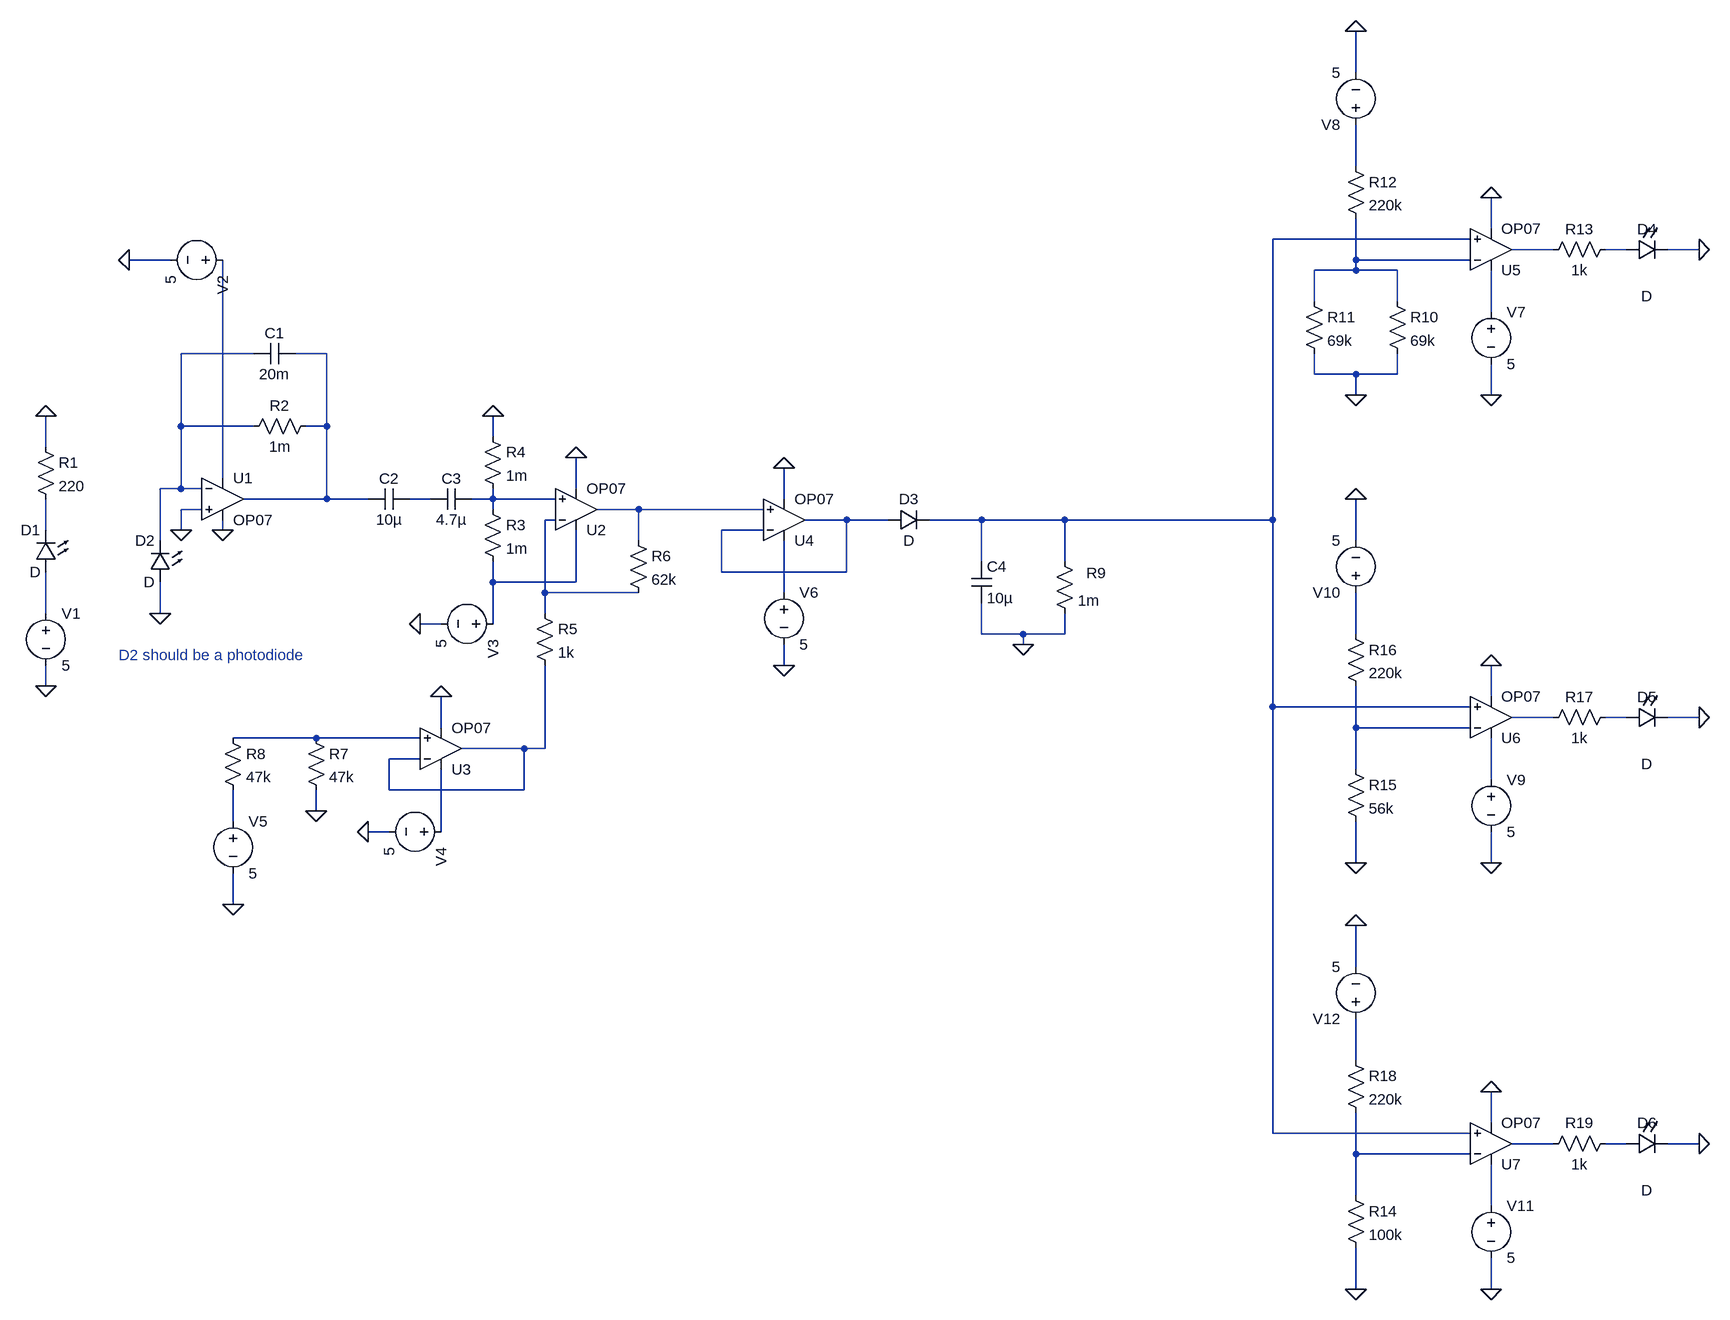
[diagram p0: schematic Inspire.asc]
Inspire.asc, the LTspice schematic file:
Version 4
SHEET 1 2692 1236
WIRE 2144 -736 2144 -800
WIRE 2144 -592 2144 -656
WIRE 2352 -496 2352 -544
WIRE 2320 -480 2016 -480
WIRE 2448 -464 2384 -464
WIRE 2560 -464 2528 -464
WIRE 2672 -464 2624 -464
WIRE 320 -448 256 -448
WIRE 2144 -448 2144 -512
WIRE 2320 -448 2144 -448
WIRE 2144 -432 2144 -448
WIRE 2144 -432 2080 -432
WIRE 2208 -432 2144 -432
WIRE 2080 -384 2080 -432
WIRE 2208 -384 2208 -432
WIRE 2352 -368 2352 -432
WIRE 448 -304 336 -304
WIRE 560 -304 512 -304
WIRE 2080 -272 2080 -304
WIRE 2144 -272 2080 -272
WIRE 2208 -272 2208 -304
WIRE 2208 -272 2144 -272
WIRE 2144 -240 2144 -272
WIRE 2352 -240 2352 -288
WIRE 336 -192 336 -304
WIRE 448 -192 336 -192
WIRE 560 -192 560 -304
WIRE 560 -192 528 -192
WIRE 816 -176 816 -208
WIRE 128 -160 128 -208
WIRE 400 -112 400 -448
WIRE 336 -96 336 -192
WIRE 336 -96 304 -96
WIRE 368 -96 336 -96
WIRE 944 -96 944 -144
WIRE 560 -80 560 -192
WIRE 560 -80 432 -80
WIRE 624 -80 560 -80
WIRE 720 -80 688 -80
WIRE 816 -80 816 -96
WIRE 816 -80 784 -80
WIRE 912 -80 816 -80
WIRE 1264 -80 1264 -128
WIRE 368 -64 336 -64
WIRE 816 -64 816 -80
WIRE 1040 -64 976 -64
WIRE 1232 -64 1040 -64
WIRE 912 -48 896 -48
WIRE 1360 -48 1296 -48
WIRE 1424 -48 1360 -48
WIRE 1568 -48 1488 -48
WIRE 1696 -48 1568 -48
WIRE 2016 -48 2016 -480
WIRE 2016 -48 1696 -48
WIRE 128 -32 128 -80
WIRE 336 -32 336 -64
WIRE 400 -32 400 -48
WIRE 1232 -32 1168 -32
WIRE 304 -16 304 -96
WIRE 1040 -16 1040 -64
WIRE 2144 -16 2144 -80
WIRE 1568 16 1568 -48
WIRE 1696 16 1696 -48
WIRE 1168 32 1168 -32
WIRE 1360 32 1360 -48
WIRE 1360 32 1168 32
WIRE 816 48 816 16
WIRE 944 48 944 -32
WIRE 944 48 816 48
WIRE 896 64 896 -48
WIRE 1040 64 896 64
WIRE 1264 64 1264 -16
WIRE 128 96 128 32
WIRE 304 96 304 48
WIRE 896 96 896 64
WIRE 736 112 704 112
WIRE 816 112 816 48
WIRE 1568 128 1568 80
WIRE 1632 128 1568 128
WIRE 1696 128 1696 96
WIRE 1696 128 1632 128
WIRE 2144 128 2144 64
WIRE 1632 144 1632 128
WIRE 1264 176 1264 144
WIRE 128 208 128 176
WIRE 2352 224 2352 176
WIRE 2016 240 2016 -48
WIRE 2320 240 2016 240
WIRE 2448 256 2384 256
WIRE 2560 256 2528 256
WIRE 2672 256 2624 256
WIRE 736 272 736 224
WIRE 2144 272 2144 208
WIRE 2320 272 2144 272
WIRE 544 288 416 288
WIRE 704 288 544 288
WIRE 864 304 768 304
WIRE 896 304 896 176
WIRE 896 304 864 304
WIRE 704 320 656 320
WIRE 2144 336 2144 272
WIRE 2352 352 2352 288
WIRE 656 368 656 320
WIRE 864 368 864 304
WIRE 864 368 656 368
WIRE 544 400 544 368
WIRE 416 416 416 368
WIRE 656 432 624 432
WIRE 736 432 736 336
WIRE 2144 480 2144 416
WIRE 2352 480 2352 432
WIRE 416 544 416 496
WIRE 2144 640 2144 576
WIRE 2144 784 2144 720
WIRE 2352 880 2352 832
WIRE 2016 896 2016 240
WIRE 2320 896 2016 896
WIRE 2448 912 2384 912
WIRE 2560 912 2528 912
WIRE 2672 912 2624 912
WIRE 2144 928 2144 864
WIRE 2320 928 2144 928
WIRE 2144 992 2144 928
WIRE 2352 1008 2352 944
WIRE 2144 1136 2144 1072
WIRE 2352 1136 2352 1088
FLAG 128 208 0
FLAG 128 -208 0
FLAG 304 96 0
FLAG 336 -32 0
FLAG 400 -32 0
FLAG 256 -448 0
FLAG 704 112 0
FLAG 944 -144 0
FLAG 816 -208 0
FLAG 624 432 0
FLAG 736 224 0
FLAG 416 544 0
FLAG 544 400 0
FLAG 1264 176 0
FLAG 1264 -128 0
FLAG 1632 144 0
FLAG 2352 -240 0
FLAG 2352 -544 0
FLAG 2144 -800 0
FLAG 2144 -240 0
FLAG 2672 -464 0
FLAG 2352 480 0
FLAG 2352 176 0
FLAG 2144 -80 0
FLAG 2144 480 0
FLAG 2672 256 0
FLAG 2352 1136 0
FLAG 2352 832 0
FLAG 2144 576 0
FLAG 2144 1136 0
FLAG 2672 912 0
SYMBOL voltage 128 80 R0
WINDOW 123 0 0 Left 0
WINDOW 39 0 0 Left 0
SYMATTR InstName V1
SYMATTR Value 5
SYMBOL LED 144 32 R180
WINDOW 0 24 64 Left 2
WINDOW 3 24 0 Left 2
SYMATTR InstName D1
SYMBOL res 112 -176 R0
SYMATTR InstName R1
SYMATTR Value 220
SYMBOL LED 320 48 R180
WINDOW 0 24 64 Left 2
WINDOW 3 24 0 Left 2
SYMATTR InstName D2
SYMBOL Opamps\\OP07 400 -144 R0
SYMATTR InstName U1
SYMBOL voltage 416 -448 R90
WINDOW 123 0 0 Left 0
WINDOW 39 0 0 Left 0
SYMATTR InstName V2
SYMATTR Value 5
SYMBOL cap 512 -320 R90
WINDOW 0 0 32 VBottom 2
WINDOW 3 32 32 VTop 2
SYMATTR InstName C1
SYMATTR Value 20m
SYMBOL res 544 -208 R90
WINDOW 0 0 56 VBottom 2
WINDOW 3 32 56 VTop 2
SYMATTR InstName R2
SYMATTR Value 1m
SYMBOL cap 688 -96 R90
WINDOW 0 0 32 VBottom 2
WINDOW 3 32 32 VTop 2
SYMATTR InstName C2
SYMATTR Value 10µ
SYMBOL cap 784 -96 R90
WINDOW 0 0 32 VBottom 2
WINDOW 3 32 32 VTop 2
SYMATTR InstName C3
SYMATTR Value 4.7µ
SYMBOL Opamps\\OP07 944 0 M180
SYMATTR InstName U2
SYMBOL voltage 832 112 R90
WINDOW 123 0 0 Left 0
WINDOW 39 0 0 Left 0
SYMATTR InstName V3
SYMATTR Value 5
SYMBOL res 800 -80 R0
SYMATTR InstName R3
SYMATTR Value 1m
SYMBOL res 800 -192 R0
SYMATTR InstName R4
SYMATTR Value 1m
SYMBOL res 880 80 R0
SYMATTR InstName R5
SYMATTR Value 1k
SYMBOL res 1024 -32 R0
SYMATTR InstName R6
SYMATTR Value 62k
SYMBOL Opamps\\OP07 736 368 M180
SYMATTR InstName U3
SYMBOL voltage 752 432 R90
WINDOW 123 0 0 Left 0
WINDOW 39 0 0 Left 0
SYMATTR InstName V4
SYMATTR Value 5
SYMBOL res 528 272 R0
SYMATTR InstName R7
SYMATTR Value 47k
SYMBOL res 400 272 R0
SYMATTR InstName R8
SYMATTR Value 47k
SYMBOL voltage 416 400 R0
WINDOW 123 0 0 Left 0
WINDOW 39 0 0 Left 0
SYMATTR InstName V5
SYMATTR Value 5
SYMBOL Opamps\\OP07 1264 16 M180
SYMATTR InstName U4
SYMBOL voltage 1264 48 R0
WINDOW 123 0 0 Left 0
WINDOW 39 0 0 Left 0
SYMATTR InstName V6
SYMATTR Value 5
SYMBOL diode 1424 -32 R270
WINDOW 0 32 32 VTop 2
WINDOW 3 0 32 VBottom 2
SYMATTR InstName D3
SYMBOL res 1680 0 R0
WINDOW 0 49 34 Left 2
SYMATTR InstName R9
SYMATTR Value 1m
SYMBOL cap 1552 16 R0
SYMATTR InstName C4
SYMATTR Value 10µ
SYMBOL Opamps\\OP07 2352 -400 M180
SYMATTR InstName U5
SYMBOL voltage 2352 -384 R0
WINDOW 123 0 0 Left 0
WINDOW 39 0 0 Left 0
SYMATTR InstName V7
SYMATTR Value 5
SYMBOL res 2192 -400 R0
SYMATTR InstName R10
SYMATTR Value 69k
SYMBOL res 2064 -400 R0
SYMATTR InstName R11
SYMATTR Value 69k
SYMBOL res 2128 -608 R0
SYMATTR InstName R12
SYMATTR Value 220k
SYMBOL voltage 2144 -640 R180
WINDOW 123 0 0 Left 0
WINDOW 39 0 0 Left 0
SYMATTR InstName V8
SYMATTR Value 5
SYMBOL res 2544 -480 R90
WINDOW 0 0 56 VBottom 2
WINDOW 3 32 56 VTop 2
SYMATTR InstName R13
SYMATTR Value 1k
SYMBOL LED 2560 -480 M90
WINDOW 0 0 32 VBottom 2
WINDOW 3 72 32 VTop 2
SYMATTR InstName D4
SYMBOL Opamps\\OP07 2352 320 M180
SYMATTR InstName U6
SYMBOL voltage 2352 336 R0
WINDOW 123 0 0 Left 0
WINDOW 39 0 0 Left 0
SYMATTR InstName V9
SYMATTR Value 5
SYMBOL res 2128 320 R0
SYMATTR InstName R15
SYMATTR Value 56k
SYMBOL res 2128 112 R0
SYMATTR InstName R16
SYMATTR Value 220k
SYMBOL voltage 2144 80 R180
WINDOW 123 0 0 Left 0
WINDOW 39 0 0 Left 0
SYMATTR InstName V10
SYMATTR Value 5
SYMBOL res 2544 240 R90
WINDOW 0 0 56 VBottom 2
WINDOW 3 32 56 VTop 2
SYMATTR InstName R17
SYMATTR Value 1k
SYMBOL LED 2560 240 M90
WINDOW 0 0 32 VBottom 2
WINDOW 3 72 32 VTop 2
SYMATTR InstName D5
SYMBOL Opamps\\OP07 2352 976 M180
SYMATTR InstName U7
SYMBOL voltage 2352 992 R0
WINDOW 123 0 0 Left 0
WINDOW 39 0 0 Left 0
SYMATTR InstName V11
SYMATTR Value 5
SYMBOL res 2128 976 R0
SYMATTR InstName R14
SYMATTR Value 100k
SYMBOL res 2128 768 R0
SYMATTR InstName R18
SYMATTR Value 220k
SYMBOL voltage 2144 736 R180
WINDOW 123 0 0 Left 0
WINDOW 39 0 0 Left 0
SYMATTR InstName V12
SYMATTR Value 5
SYMBOL res 2544 896 R90
WINDOW 0 0 56 VBottom 2
WINDOW 3 32 56 VTop 2
SYMATTR InstName R19
SYMATTR Value 1k
SYMBOL LED 2560 896 M90
WINDOW 0 0 32 VBottom 2
WINDOW 3 72 32 VTop 2
SYMATTR InstName D6
TEXT 240 160 Left 2 ;D2 should be a photodiode

The netlist it stands for:
* Inspire.asc
V1 N018 0 5
D1 N018 N015 D
R1 0 N015 220
D2 0 N007 D
XU1 0 N007 N009 0 N008 LT1001  ; OP07, pins In+ In- V+ V- OUT
V2 N009 0 5
C1 N008 N007 20m
R2 N008 N007 1m
C2 N010 N008 10µ
C3 N011 N010 4.7µ
XU2 N011 N013 N016 0 N012 LT1001  ; OP07, pins In+ In- V+ V- OUT
V3 N016 0 5
R3 N011 N016 1m
R4 0 N011 1m
R5 N013 N024 1k
R6 N012 N013 62k
XU3 N023 N024 N027 0 N024 LT1001  ; OP07, pins In+ In- V+ V- OUT
V4 N027 0 5
R7 N023 0 47k
R8 N023 N026 47k
V5 N026 0 5
XU4 N012 N014 N017 0 N014 LT1001  ; OP07, pins In+ In- V+ V- OUT
V6 N017 0 5
D3 N014 N002 D
R9 N002 0 1m
C4 N002 0 10µ
XU5 N002 N005 N006 0 N003 LT1001  ; OP07, pins In+ In- V+ V- OUT
V7 N006 0 5
R10 N005 0 69k
R11 N005 0 69k
R12 N001 N005 220k
V8 N001 0 5
R13 N004 N003 1k
D4 N004 0 D
XU6 N002 N022 N025 0 N020 LT1001  ; OP07, pins In+ In- V+ V- OUT
V9 N025 0 5
R15 N022 0 56k
R16 N019 N022 220k
V10 N019 0 5
R17 N021 N020 1k
D5 N021 0 D
XU7 N002 N031 N032 0 N029 LT1001  ; OP07, pins In+ In- V+ V- OUT
V11 N032 0 5
R14 N031 0 100k
R18 N028 N031 220k
V12 N028 0 5
R19 N030 N029 1k
D6 N030 0 D
.model D D
.lib standard.dio
* D2 should be a photodiode
.lib LTC.lib
.backanno
.end